# Altium schematic sheet Substractor.SchDoc
size A; SheetNumber: 2; SheetTotal: 8
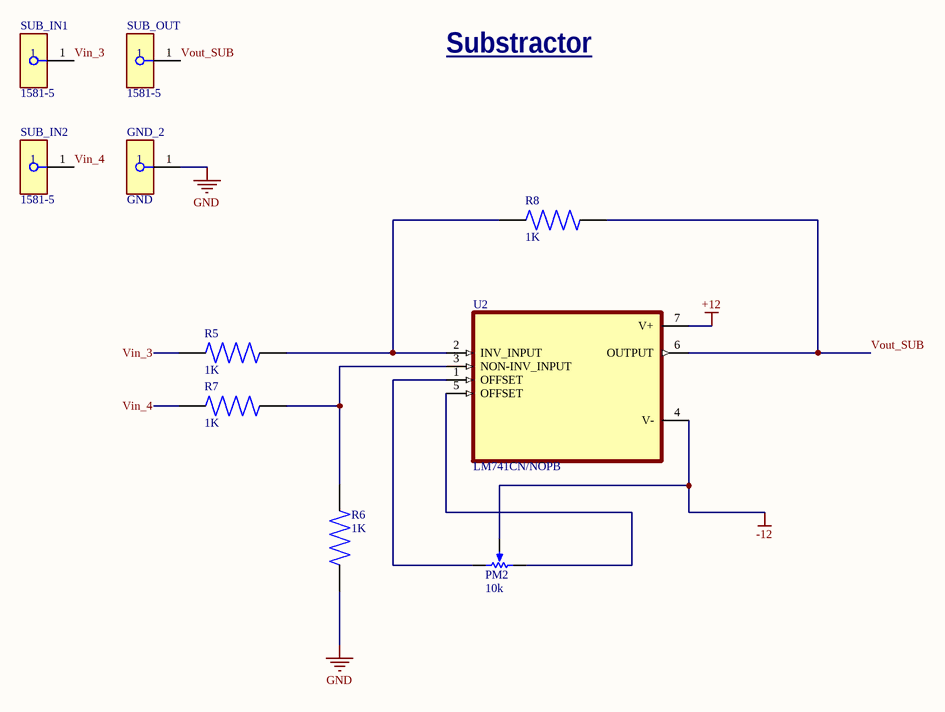
[diagram p0: Substractor.SchDoc]

## Parts
GND_2  GND  [FP-1581-5-MFG]
PM2  10k  [BOUR-3362P]
R5  1K  [RESAD1100W55L680D260]
R6  1K  [RESAD1100W55L680D260]
R7  1K  [RESAD1100W55L680D260]
R8  1K  [RESAD1100W55L680D260]
SUB_IN1  1581-5  [FP-1581-5-MFG]
SUB_IN2  1581-5  [FP-1581-5-MFG]
SUB_OUT  1581-5  [FP-1581-5-MFG]
U2  LM741CN/NOPB  [DIP794W45P254L959H508Q8]

## Nets
+12: U2.7(V+)
-12: PM2.2(S) U2.4(V-)
GND: GND_2.1 R6.1
Vin_3: R5.1 SUB_IN1.1
Vin_4: R7.1 SUB_IN2.1
Vout_SUB: R8.2 SUB_OUT.1 U2.6(OUTPUT)
NetPM2_1: PM2.1(CCW) U2.5(OFFSET)
NetPM2_3: PM2.3(CW) U2.1(OFFSET)
NetR5_2: R5.2 R8.1 U2.2(INV_INPUT)
NetR6_2: R6.2 R7.2 U2.3(NON-INV_INPUT)

## Notes on the sheet
- Substractor

## Library data of the parts
GND_2 SUB_IN1 SUB_IN2 SUB_OUT = CMP-73906-000011-1: CONN BANANA JACK TURRET GREEN; Body Material: PC; Number of Contacts: 1; Max Current Rating: 15A; Voltage Rating (AC): 30V; Insulation: Mating End Insulated; Voltage Rating: 2.5kV; Voltage Rating (DC): 60V; Gender: Female; Height: 0.25inch; Mount: Panel; RoHS Compliant: Yes; Length: 1.22inch; Orientation: Straight; Diameter: 4.22mm; Lead Free: Lead Free; Package Quantity: 1; Termination: Turret; Current Rating: 15A; Packaging: Bag; Series: 1581; REACH SVHC: No SVHC; Number of Positions: 1; Contact Plating: Tin; Housing Color: Green; Contact Material: Brass; Insulation Material: Polycarbonate; Weight: 0.126lb; Number of Ports: 1; Color: Green; Housing Material: Polycarbonate; Width: 4inch
PM2 = CMP-1747-00004-1: Square Trimpot(R) Trimming Potentiometer, 10 KOhm, 300 V, -55 to 125 degC, 3-Pin THD, RoHS, Tube; Voltage Rating: 220 mV; Power Rating: 1 W; Tolerance: 1%; Resistance: 50 mohm; Case/Package: 1206; Length: 3.2 mm; RoHSCompliant: True; PackageDescription: 3-Pin Through Hole Device, Body 6.6 x 6.99 mm, Pitch 2.54 mm; ComponentLink2Description: Datasheet; REACH SVHC: No SVHC; Mount: Surface Mount; Height: 0.6 mm; Packaging: Tape and Reel; ComponentLink1URL: http://www.bourns.com/; Case Code (Imperial): 0612; Pins: 2; Case Code (Metric): 1632; ComponentLink2URL: http://www.bourns.com/docs/Product-Datasheets/3362.pdf; Min Operating Temperature: -25degC; ComponentLink1Description: Manufacturer URL; PackageReference: 3326P; Max Operating Temperature: 125degC; Width: 1.6 mm; Package Quantity: 5000; DatasheetVersion: May-16
R5-R8 = MFR-25FBF52-1K: 1.07 kOhms Â±1% 0.25W, 1/4W Through Hole Resistor Axial - Metal Film; MF: Yageo; SnapEDA_Link: https://www.snapeda.com/parts/MFR-25FBF52-1K/Yageo/view-part/?ref=snap; Package: RADIAL-2 YAGEO; Value: *; MP: MFR-25FBF52-1K; Check_prices: https://www.snapeda.com/parts/MFR-25FBF52-1K/Yageo/view-part/?ref=eda
U2 = LM741CN/NOPB: Single, 44-V, 1-MHz operational amplifier; MF: Texas Instruments; SnapEDA_Link: https://www.snapeda.com/parts/LM741CN/NOPB/Texas+Instruments/view-part/?ref=snap; Package: PDIP-8 Texas; Value: *; MP: LM741CN/NOPB; Check_prices: https://www.snapeda.com/parts/LM741CN/NOPB/Texas+Instruments/view-part/?ref=eda